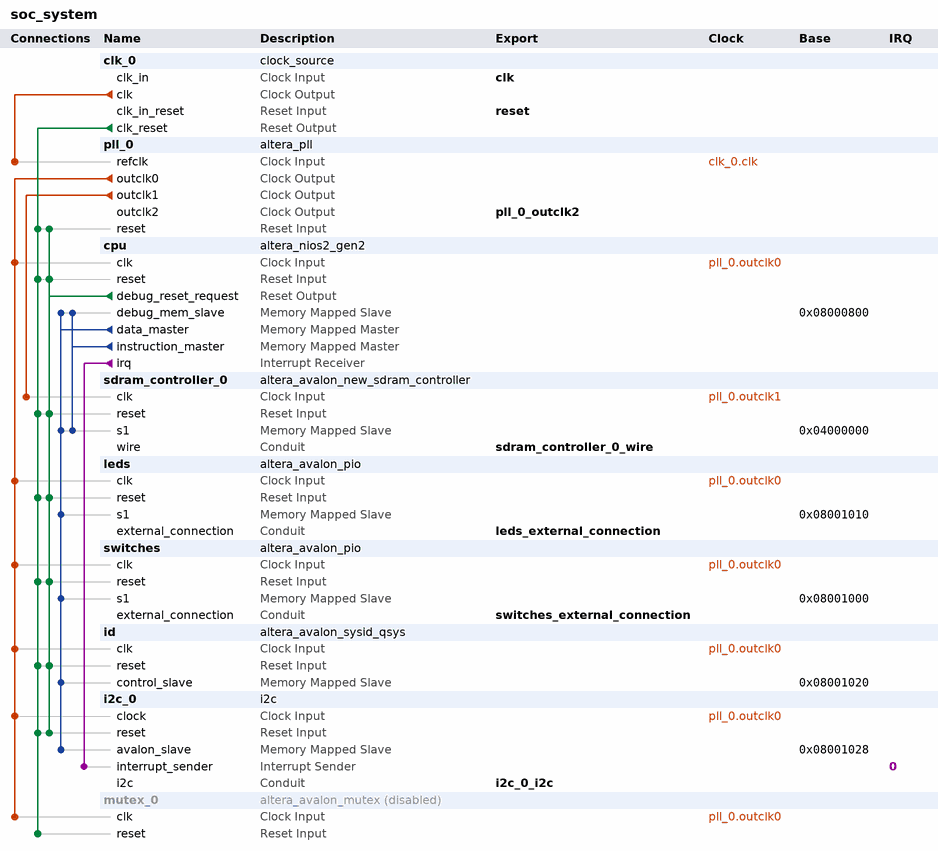
[diagram p0: system contents]
# Platform Designer (Qsys) system soc_system, Cyclone V 5CGXFC7C7F23C8
# Parameters at their usual value, and those the tool derives, are not listed.
package require -exact qsys 18.1
create_system soc_system
set_project_property DEVICE_FAMILY {Cyclone V}
set_project_property DEVICE 5CGXFC7C7F23C8

add_instance clk_0 clock_source 18.1
set_instance_parameter_value clk_0 clockFrequency 50000000

add_instance pll_0 altera_pll 18.1
set_instance_parameter_value pll_0 gui_device_speed_grade 1
set_instance_parameter_value pll_0 gui_number_of_clocks 3
set_instance_parameter_value pll_0 gui_operation_mode direct
set_instance_parameter_value pll_0 gui_output_clock_frequency0 50.0
set_instance_parameter_value pll_0 gui_output_clock_frequency1 100.0
set_instance_parameter_value pll_0 gui_output_clock_frequency2 100.0
set_instance_parameter_value pll_0 gui_phase_shift2 -3758
set_instance_parameter_value pll_0 gui_pll_mode {Integer-N PLL}
set_instance_parameter_value pll_0 gui_reference_clock_frequency 50.0
set_instance_parameter_value pll_0 gui_use_locked false

add_instance cpu altera_nios2_gen2 18.1
set_instance_parameter_value cpu dcache_size 2048
set_instance_parameter_value cpu exceptionSlave sdram_controller_0.s1
set_instance_parameter_value cpu icache_size 4096
set_instance_parameter_value cpu impl Fast
set_instance_parameter_value cpu resetSlave sdram_controller_0.s1

add_instance sdram_controller_0 altera_avalon_new_sdram_controller 18.1
set_instance_parameter_value sdram_controller_0 TAC 5.4
set_instance_parameter_value sdram_controller_0 TRCD 15.0
set_instance_parameter_value sdram_controller_0 TRP 15.0
set_instance_parameter_value sdram_controller_0 casLatency 3
set_instance_parameter_value sdram_controller_0 columnWidth 10
set_instance_parameter_value sdram_controller_0 dataWidth 16
set_instance_parameter_value sdram_controller_0 generateSimulationModel false
set_instance_parameter_value sdram_controller_0 model single_Micron_MT48LC4M32B2_7_chip
set_instance_parameter_value sdram_controller_0 numberOfBanks 4
set_instance_parameter_value sdram_controller_0 numberOfChipSelects 1
set_instance_parameter_value sdram_controller_0 powerUpDelay 100.0
set_instance_parameter_value sdram_controller_0 refreshPeriod 7.8125
set_instance_parameter_value sdram_controller_0 rowWidth 13

add_instance leds altera_avalon_pio 18.1
set_instance_parameter_value leds direction Output
set_instance_parameter_value leds width 10

add_instance switches altera_avalon_pio 18.1
set_instance_parameter_value switches direction Input
set_instance_parameter_value switches width 10

add_instance id altera_avalon_sysid_qsys 18.1
set_instance_parameter_value id id 0

add_instance i2c_0 i2c 15.1

add_instance mutex_0 altera_avalon_mutex 18.1
set_instance_property mutex_0 ENABLED false

# connections
add_connection clk_0.clk pll_0.refclk clock
add_connection pll_0.outclk0 cpu.clk clock
add_connection pll_0.outclk0 i2c_0.clock clock
add_connection pll_0.outclk0 id.clk clock
add_connection pll_0.outclk0 leds.clk clock
add_connection pll_0.outclk0 mutex_0.clk clock
add_connection pll_0.outclk0 switches.clk clock
add_connection pll_0.outclk1 sdram_controller_0.clk clock
add_connection clk_0.clk_reset cpu.reset reset
add_connection clk_0.clk_reset i2c_0.reset reset
add_connection clk_0.clk_reset id.reset reset
add_connection clk_0.clk_reset leds.reset reset
add_connection clk_0.clk_reset mutex_0.reset reset
add_connection clk_0.clk_reset pll_0.reset reset
add_connection clk_0.clk_reset sdram_controller_0.reset reset
add_connection clk_0.clk_reset switches.reset reset
add_connection cpu.debug_reset_request cpu.reset reset
add_connection cpu.debug_reset_request i2c_0.reset reset
add_connection cpu.debug_reset_request id.reset reset
add_connection cpu.debug_reset_request leds.reset reset
add_connection cpu.debug_reset_request pll_0.reset reset
add_connection cpu.debug_reset_request sdram_controller_0.reset reset
add_connection cpu.debug_reset_request switches.reset reset
add_connection cpu.data_master cpu.debug_mem_slave avalon
set_connection_parameter_value cpu.data_master/cpu.debug_mem_slave baseAddress 0x08000800
add_connection cpu.data_master i2c_0.avalon_slave avalon
set_connection_parameter_value cpu.data_master/i2c_0.avalon_slave baseAddress 0x08001028
add_connection cpu.data_master id.control_slave avalon
set_connection_parameter_value cpu.data_master/id.control_slave baseAddress 0x08001020
add_connection cpu.data_master leds.s1 avalon
set_connection_parameter_value cpu.data_master/leds.s1 baseAddress 0x08001010
add_connection cpu.data_master sdram_controller_0.s1 avalon
set_connection_parameter_value cpu.data_master/sdram_controller_0.s1 baseAddress 0x04000000
add_connection cpu.data_master switches.s1 avalon
set_connection_parameter_value cpu.data_master/switches.s1 baseAddress 0x08001000
add_connection cpu.instruction_master cpu.debug_mem_slave avalon
set_connection_parameter_value cpu.instruction_master/cpu.debug_mem_slave baseAddress 0x08000800
add_connection cpu.instruction_master sdram_controller_0.s1 avalon
set_connection_parameter_value cpu.instruction_master/sdram_controller_0.s1 baseAddress 0x04000000
add_connection cpu.irq i2c_0.interrupt_sender interrupt
set_connection_parameter_value cpu.irq/i2c_0.interrupt_sender irqNumber 0

# exported interfaces
add_interface clk clock sink
set_interface_property clk EXPORT_OF clk_0.clk_in
add_interface i2c_0_i2c conduit end
set_interface_property i2c_0_i2c EXPORT_OF i2c_0.i2c
add_interface leds_external_connection conduit end
set_interface_property leds_external_connection EXPORT_OF leds.external_connection
add_interface pll_0_outclk2 clock source
set_interface_property pll_0_outclk2 EXPORT_OF pll_0.outclk2
add_interface reset reset sink
set_interface_property reset EXPORT_OF clk_0.clk_in_reset
add_interface sdram_controller_0_wire conduit end
set_interface_property sdram_controller_0_wire EXPORT_OF sdram_controller_0.wire
add_interface switches_external_connection conduit end
set_interface_property switches_external_connection EXPORT_OF switches.external_connection

set_interconnect_requirement {$system} qsys_mm.clockCrossingAdapter HANDSHAKE
set_interconnect_requirement {$system} qsys_mm.enableEccProtection FALSE
set_interconnect_requirement {$system} qsys_mm.insertDefaultSlave FALSE
set_interconnect_requirement {$system} qsys_mm.maxAdditionalLatency 1

save_system soc_system.qsys
